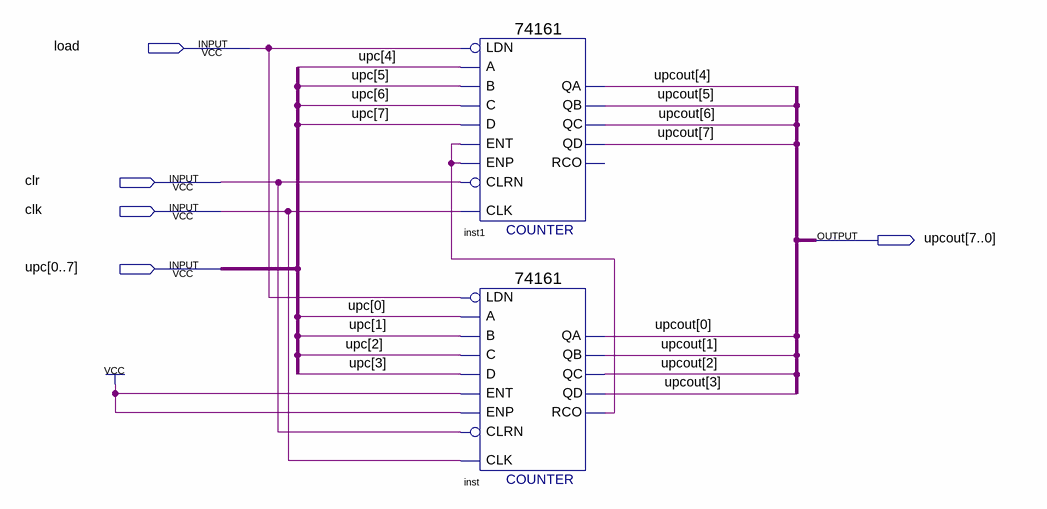
[diagram p0: schematic sheet]
// Quartus schematic upc.bdf as structural Verilog: 2 symbols, 5 pins
module upc (
  input  load,
  input  clr,
  input  clk,
  input  [0:7] upc,
  output [7:0] upcout
);

  wire inst_rco;

  \74161  inst1 (
    .CLRN(clr), .CLK(clk), .ENP(inst_rco), .LDN(load), .A(upc[4]), .D(upc[7]), .ENT(inst_rco), .B(upc[5]),
    .C(upc[6]), .QD(upcout[7]), .QC(upcout[6]), .QB(upcout[5]), .QA(upcout[4]));  // open: RCO
  \74161  inst (
    .CLRN(clr), .CLK(clk), .ENP(1'b1), .LDN(load), .A(upc[0]), .D(upc[3]), .ENT(1'b1), .B(upc[1]),
    .C(upc[2]), .QD(upcout[3]), .QC(upcout[2]), .QB(upcout[1]), .QA(upcout[0]), .RCO(inst_rco));
endmodule
